# EAGLE board Schematic (EAGLE 9.6.2)
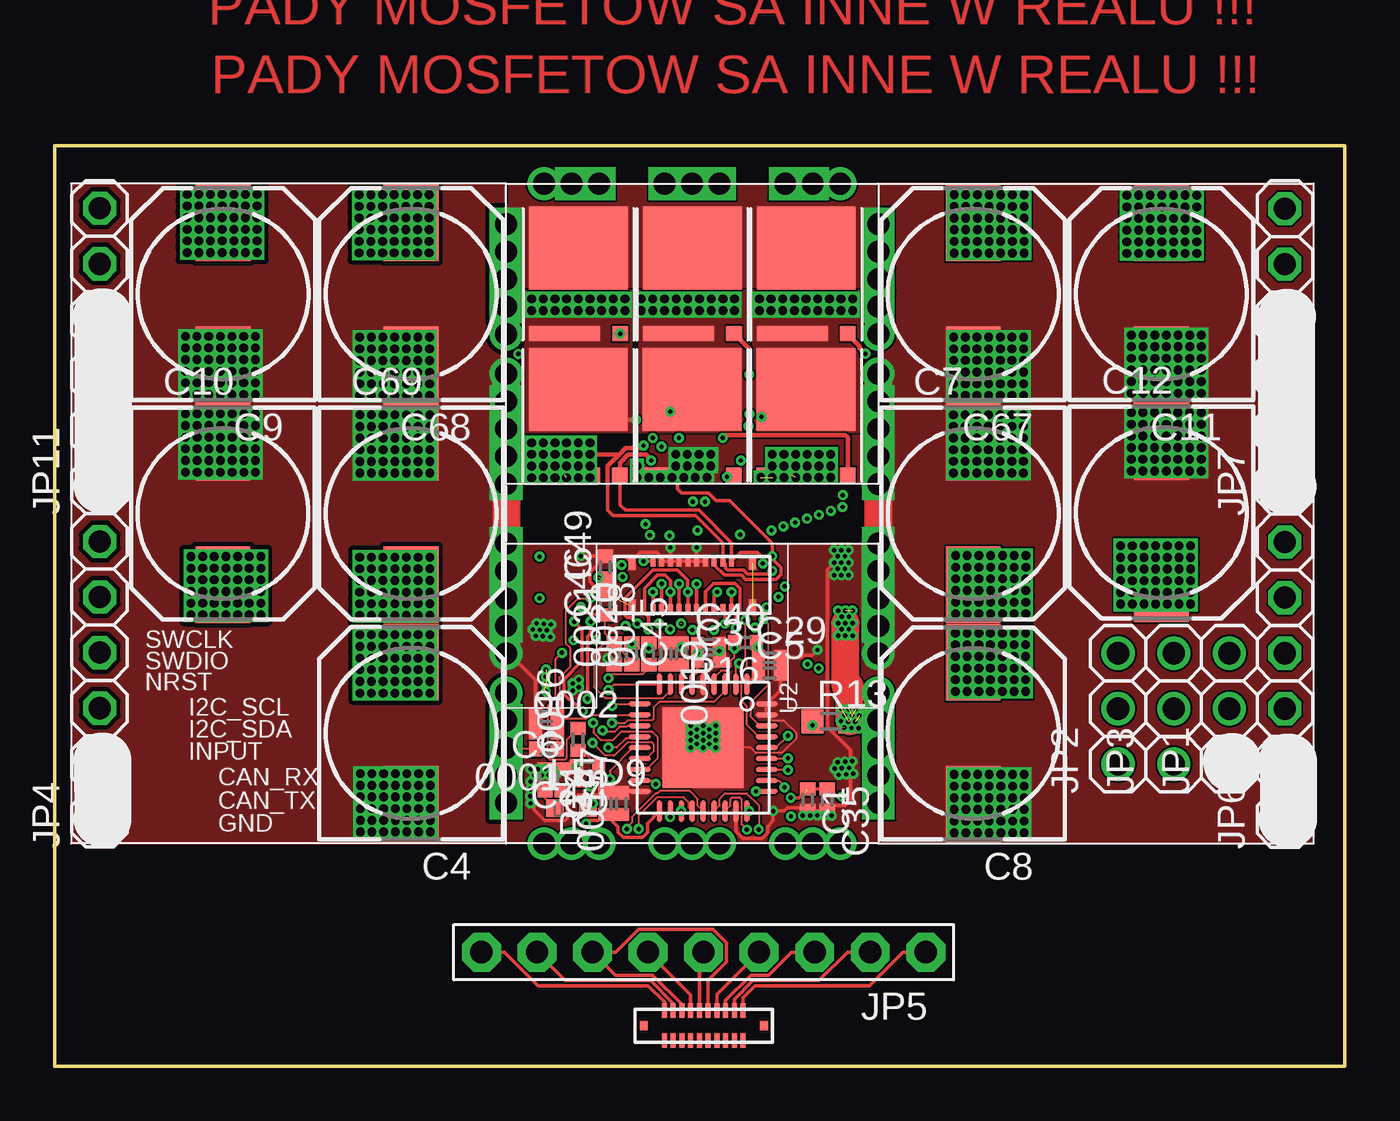
[diagram p1: board, top side]
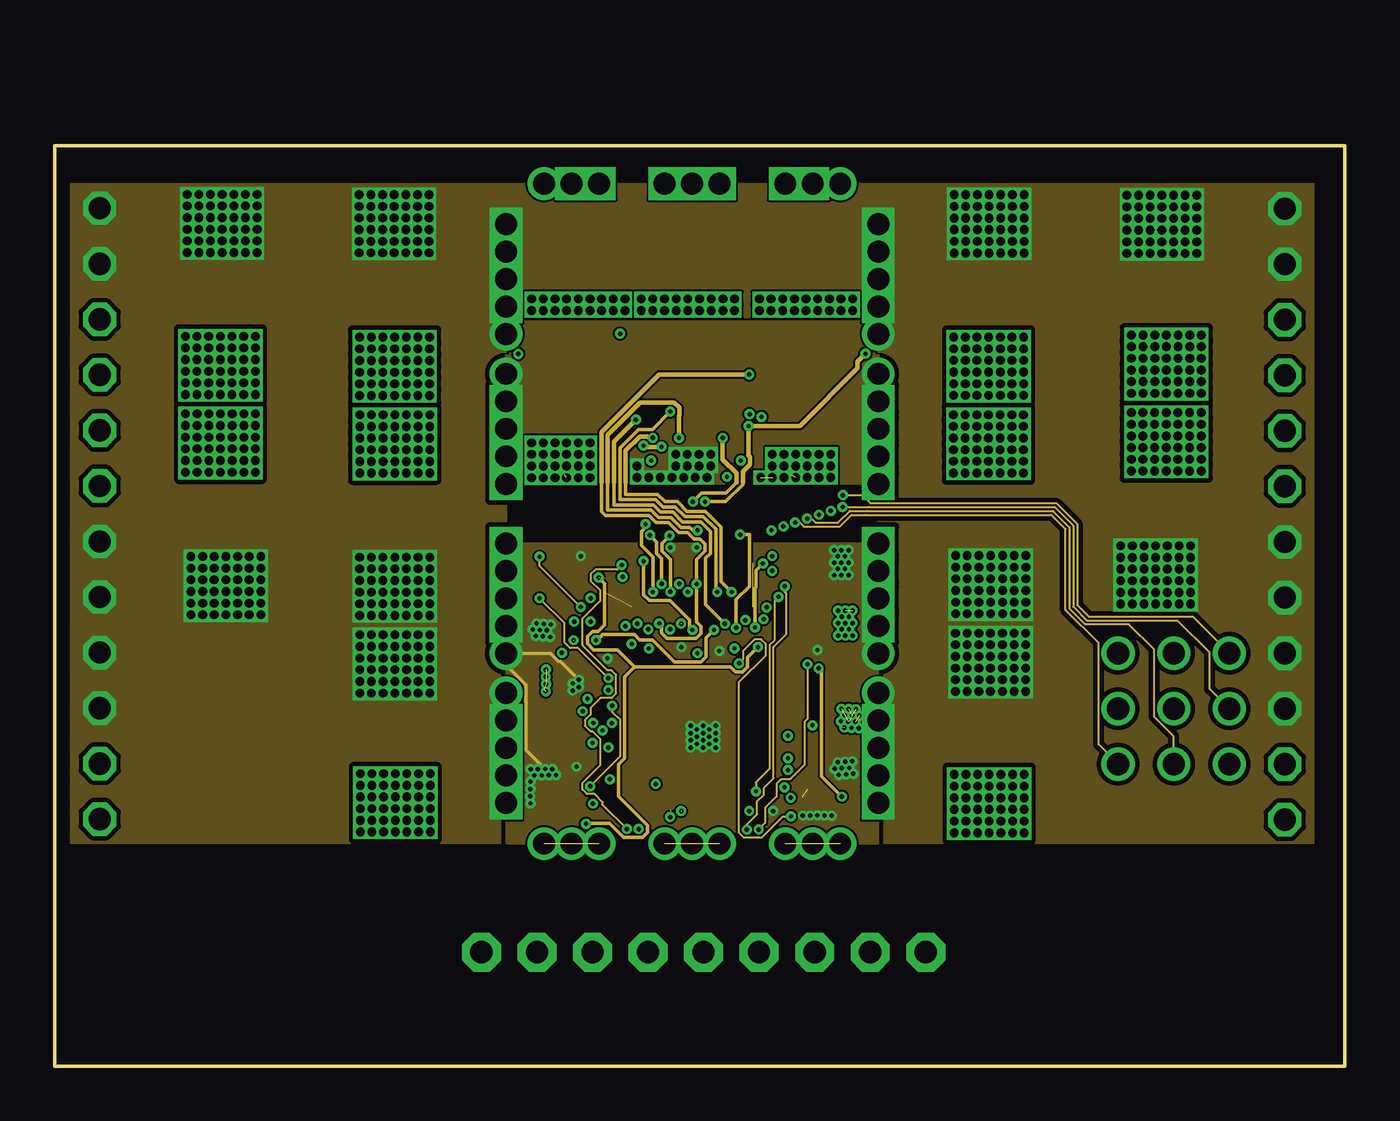
[diagram p2: board, inner layer Route2]
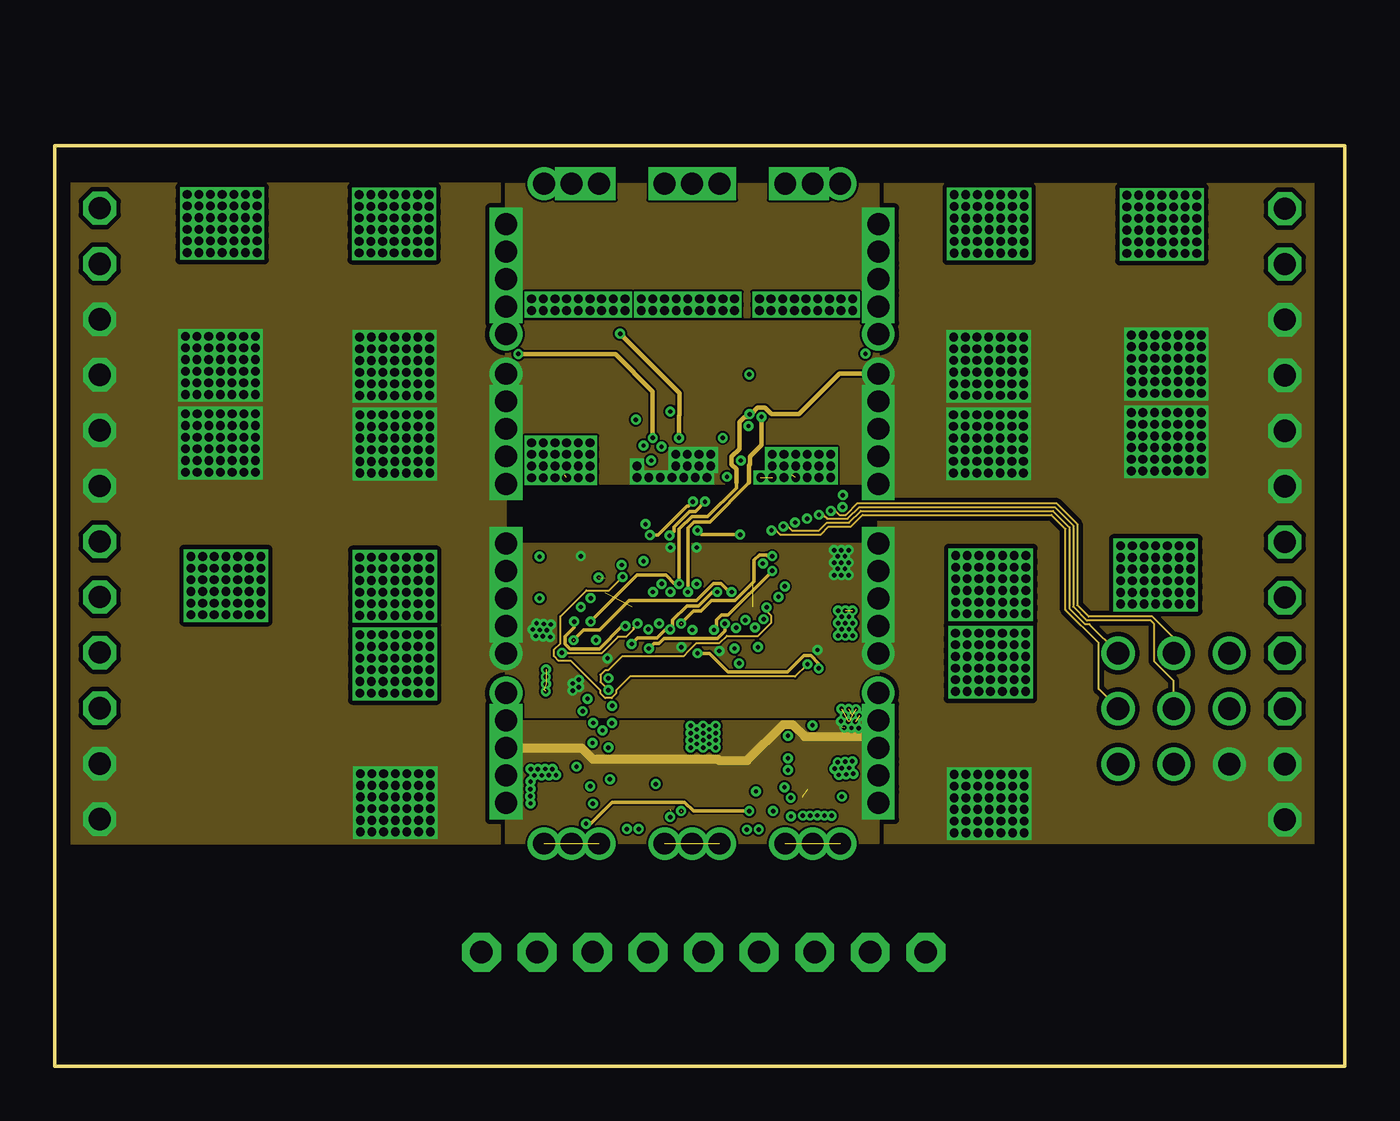
[diagram p3: board, inner layer Route15]
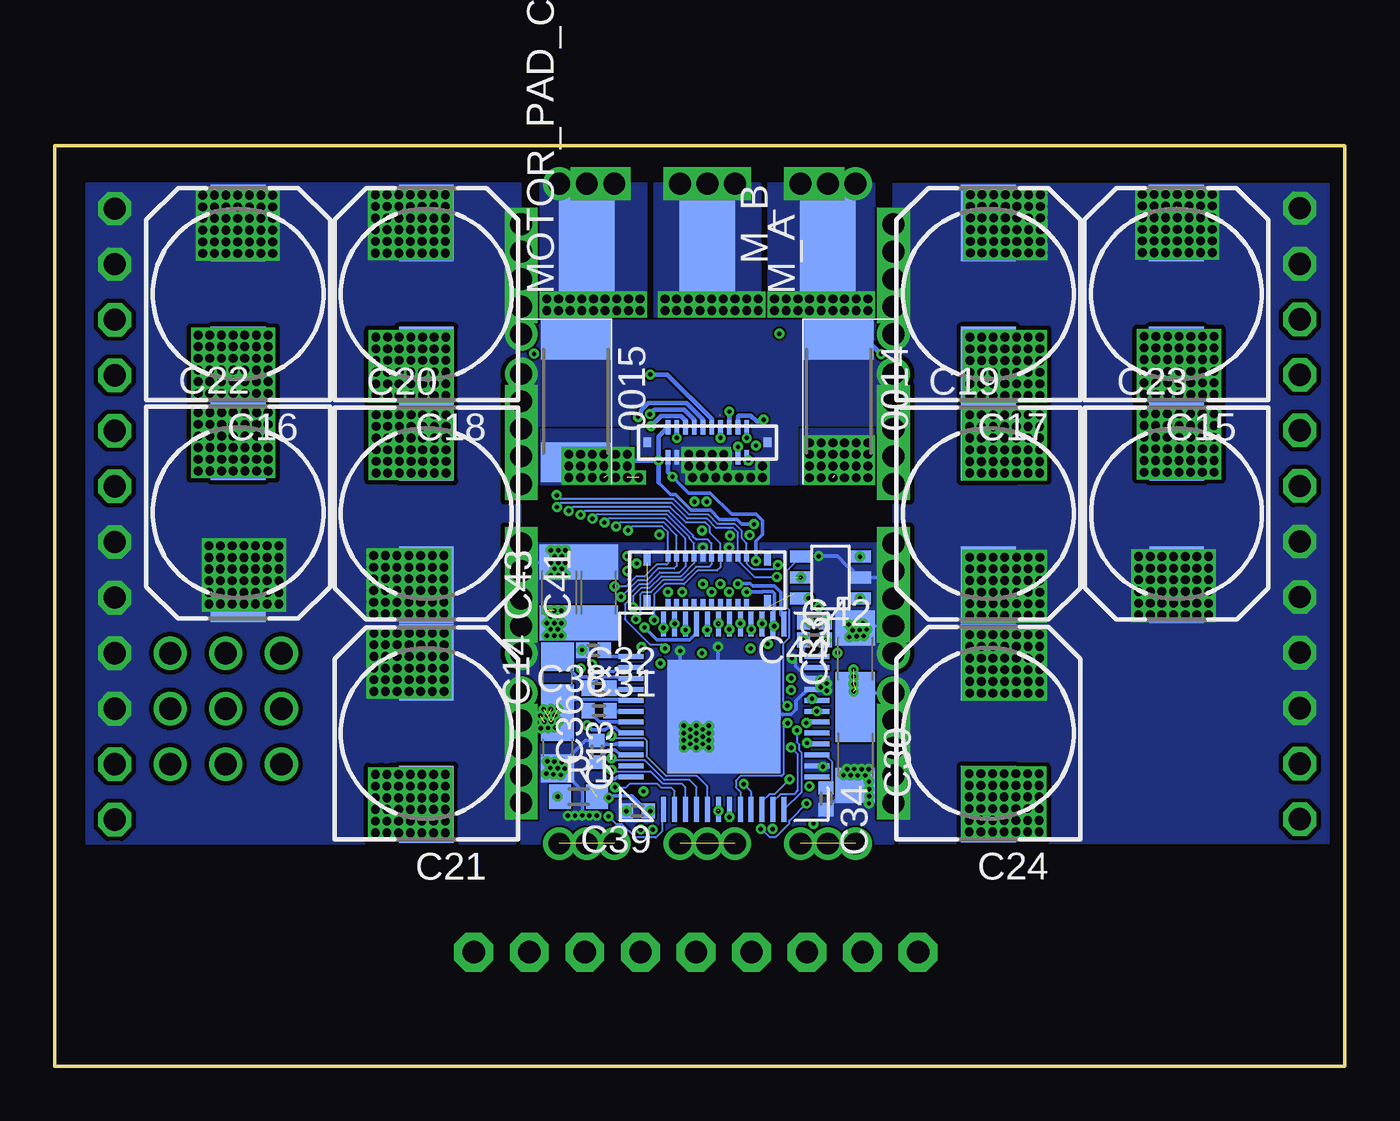
[diagram p4: board, bottom side, seen from below]

Size 59 x 42.08 mm. Coordinates in mm from the lower left corner, seen from the top.
Outline: 0,0 0,42.08 59,42.08 59,0 0,0
Copper layers (1*2*15*16): Top 0.035mm / dielectric 0.2mm / Route2 0.017mm / dielectric 0.2mm / Route15 0.017mm / dielectric 0.2mm / Bottom 0.035mm
Design rules "default *": minimum track width 3.5mil, minimum drill 0.2mm, track to track 3.5mil, track to pad 3.5mil, pad to pad 3.5mil, via to via 3.5mil, smd to smd 0mil, copper to edge 0mil, drill to drill 0mil, minimum pad ring 5mil, minimum via ring 5mil, stop-mask expansion 1mil, vias tented up to drill 0mil, thermal gap 0mil

## Footprints (pad centres in the part's own frame; a part is rotated, then mirrored left to right if it is on the bottom)
R0402 = smd 0.6 x 0.7: 1 -0.5,0; 2 0.5,0
R2512 = smd 1.8 x 3.2: 1 -2.8,0; 2 2.8,0
150CLZ-0810 = smd 3.5 x 2.5: + 3.25,0; - -3.25,0
C0805 = smd 1.3 x 1.5: 1 -0.95,0; 2 0.95,0
C1206 = smd 1.6 x 1.8: 1 -1.4,0; 2 1.4,0
1X03 = drill 1.016: 1 -2.54,0; 2 0,0; 3 2.54,0
1X06 = drill 1.016 octagon: 1 -6.35,0; 2 -3.81,0; 3 -1.27,0; 4 1.27,0; 5 3.81,0; 6 6.35,0
1X09-BIG = drill 1.016 pad 1.778 octagon: 1 -10.16,0; 2 -7.62,0; 3 -5.08,0; 4 -2.54,0; 5 0,0; 6 2.54,0; 7 5.08,0; 8 7.62,0; 9 10.16,0
SML0603 = smd 0.8 x 0.8: A 0.75,0; C -0.75,0
SMD2,54-5,08 = smd 2.54 x 5.08: 1 0,0
R0603 = smd 1 x 1.1: 1 -0.85,0; 2 0.85,0
VFQFPN36-HS = smd 1 x 0.23: 1 -2.9,2; 2 -2.9,1.5; 3 -2.9,1; 4 -2.9,0.5; 5 -2.9,0; 6 -2.9,-0.5; 7 -2.9,-1; 8 -2.9,-1.5; 9 -2.9,-2; 19 2.9,-2; 20 2.9,-1.5; 21 2.9,-1; 22 2.9,-0.5; 23 2.9,0; 24 2.9,0.5; 25 2.9,1; 26 2.9,1.5; 27 2.9,2 | smd 0.23 x 1: 10 -2,-2.9; 11 -1.5,-2.9; 12 -1,-2.9; 13 -0.5,-2.9; 14 0,-2.9; 15 0.5,-2.9; 16 1,-2.9; 17 1.5,-2.9; 18 2,-2.9; 28 2,2.9; 29 1.5,2.9; 30 1,2.9; 31 0.5,2.9; 32 0,2.9; 33 -0.5,2.9; 34 -1,2.9; 35 -1.5,2.9; 36 -2,2.905 | smd 3.7 x 3.7: GND 0,0
RECEPTACLE_20_0.4_5024262030 = smd 0.32 x 0.65: CASE_11 -0.95,-0.1; CASE_12 -0.95,-2.1; CASE_21 4.55,-0.1; CASE_22 4.55,-2.1 | smd 0.22 x 0.475: P$1 0,0; P$2 0.4,0; P$3 0.8,0; P$4 1.2,0; P$5 1.6,0; P$6 2,0; P$7 2.4,0; P$8 2.8,0; P$9 3.2,0; P$10 3.6,0; P$11 0,-2.19; P$12 0.4,-2.19; P$13 0.8,-2.19; P$14 1.2,-2.19; P$15 1.6,-2.19; P$16 2,-2.19; P$17 2.4,-2.19; P$18 2.8,-2.19; P$19 3.2,-2.19; P$20 3.6,-2.19
PLUG_20_0.4_5024302012 = smd 0.35 x 0.44: CASE_1 -0.95,-0.69; CASE_2 4.55,-0.69 | smd 0.22 x 0.66: P$1 0,0; P$2 0.4,0; P$3 0.8,0; P$4 1.2,0; P$5 1.6,0; P$6 2,0; P$7 2.4,0; P$8 2.8,0; P$9 3.2,0; P$10 3.6,0; P$11 0,-1.38; P$12 0.4,-1.38; P$13 0.8,-1.38; P$14 1.2,-1.38; P$15 1.6,-1.38; P$16 2,-1.38; P$17 2.4,-1.38; P$18 2.8,-1.38; P$19 3.2,-1.38; P$20 3.6,-1.38
S-PQFP-G48 = smd 0.229 x 1.143: 1-EN_GATE 0,0; 2-INHA 0.5,0; 3-INLA 1,0; 4-INHB 1.5,0; 5-INLB 2,0; 6-INHC 2.5,0; 7-INLC 3,0; 8-NFAULT 3.5,0; 9-NSCS 4,0; 10-SDI 4.5,0; 11-SDO 5,0; 12-SCLK 5.5,0; 25-GL_C 5.5,8.5; 26-SL_C 5,8.5; 27-SH_C 4.5,8.5; 28_GH_C 4,8.5; 29-GH_B 3.5,8.5; 30-SH_B 3,8.5; 31-SL_B 2.5,8.5; 32-GL_B 2,8.5; 33-GL_A 1.5,8.5; 34-SL_A 1,8.5; 35-SH_A 0.5,8.5; 36-GH_A 0,8.5 | smd 1.143 x 0.229: 13-PWRGD 7,1.5; 14-GND1 7,2; 15-AVDD 7,2.5; 16-SO1 7,3; 17-SO2 7,3.5; 18-SO3 7,4; 19-SN3 7,4.5; 20-SP3 7,5; 21-SN2 7,5.5; 22-SP2 7,6; 23-SN1 7,6.5; 24-SP1 7,7; 37-VCP_LSD -1.5,7; 38-VCPH -1.5,6.5; 39-CP2H -1.5,6; 40-CP2L -1.5,5.5; 41-PVDD -1.5,5; 42-CP1L -1.5,4.5; 43-CP1H -1.5,4; 44-VDRAIN -1.5,3.5; 45-GND2 -1.5,3; 46-DVDD -1.5,2.5; 47-WAKE -1.5,2; 48-VREG -1.5,1.5 | smd 5.17 x 5.17: GND 2.75,4.25
Q5B = smd 3.8 x 4.52: D -0.4,-0.635 | smd 0.686 x 0.71: G 3.51,1.27 | smd 0.686 x 3.25: S 3.51,-1.27
SOT-23 = smd 0.55 x 1: 1 0,0; 2 0.95,0; 3 1.9,0; 4 1.9,2.7; 5 0.95,2.7; 6 0,2.7

## Placement (x,y rotation side)
0001  34.8kR  [R0402]  22.49,14.5 180 top
0002  4.99kR  [R0402]  22.49,15.29 0 top
0014  5mohm  [R2512]  23.15,30.41 270 bottom
0015  5mohm  [R2512]  35.16,30.41 270 bottom
0016  34.8kR  [R0402]  23.93,14.94 90 top
0017  4.99kR  [R0402]  23.22,13.09 270 top
0018  34.8kR  [R0402]  27.17,18.85 90 top
0019  4.99kR  [R0402]  27.96,18.85 270 top
0020  34.8kR  [R0402]  26.38,18.85 90 top
0021  4.99kR  [R0402]  25.6,18.85 90 top
C1  100nF  [R0402]  34.44,12.18 270 top
C2  100nF  [R0402]  25.21,12 90 top
C3  100nF  [R0402]  29.9,18.58 0 top
C4  220uf  [150CLZ-0810]  16.3,15.22 90 top
C5  100nF  [R0402]  32.68,17.98 0 top
C6  100nF  [R0402]  22.49,15.99 180 top
C7  220uf  [150CLZ-0810]  42.01,25.27 270 top
C8  220uf  [150CLZ-0810]  42.01,15.21 90 top
C9  220uf  [150CLZ-0810]  7.7,35.31 90 top
C10  220uf  [150CLZ-0810]  7.7,25.27 270 top
C11  220uf  [150CLZ-0810]  50.61,35.31 90 top
C12  220uf  [150CLZ-0810]  50.61,25.31 270 top
C13  4.7uF  [C0805]  36,14.56 270 bottom
C14  4.7uF  [C0805]  36,17.76 90 bottom
C15  220uf  [150CLZ-0810]  7.7,35.31 90 bottom
C16  220uf  [150CLZ-0810]  50.61,35.31 90 bottom
C17  220uf  [150CLZ-0810]  16.3,35.31 90 bottom
C18  220uf  [150CLZ-0810]  42.01,35.31 90 bottom
C19  220uf  [150CLZ-0810]  16.3,25.27 270 bottom
C20  220uf  [150CLZ-0810]  42.01,25.27 270 bottom
C21  220uf  [150CLZ-0810]  42.01,15.21 90 bottom
C22  220uf  [150CLZ-0810]  50.61,25.31 270 bottom
C23  220uf  [150CLZ-0810]  7.7,25.27 270 bottom
C24  220uf  [150CLZ-0810]  16.3,15.22 90 bottom
C29  4.7uF  [R0402]  32.68,18.68 0 top
C30  22uF  [C1206]  22.38,14.23 270 bottom
C31  0.047uF  [R0402]  34.11,16.25 0 bottom
C32  0.047uF  [R0402]  34.11,17.28 0 bottom
C33  22uF  [C1206]  22.38,18.63 90 bottom
C34  1uF  [R0402]  23.72,12.22 270 bottom
C35  4.7uF  [R0402]  35.33,12.18 270 top
C36  1uF  [R0402]  34.2,14.4 90 bottom
C37  4.7uF  [R0402]  25.91,12 90 top
C38  1uF  [R0402]  34.37,19.01 180 bottom
C39  1uF  [R0402]  32.35,11.66 180 bottom
C40  4.7uF  [R0402]  29.9,19.28 0 top
C41  22uF  [C1206]  34.12,21.65 90 bottom
C42  1nF  [R0402]  24.26,19.48 0 bottom
C43  22uF  [C1206]  35.92,21.65 90 bottom
C44  1nF  [R0402]  24.26,20.33 180 bottom
C45  100nF  [R0402]  28.66,18.85 90 top
C46  100nF  [R0402]  25.18,21.13 90 top
C47  100nF  [R0402]  24.36,13.69 180 top
C49  100nF  [R0402]  25.18,22.82 90 top
C67  220uf  [150CLZ-0810]  42.01,35.31 90 top
C68  220uf  [150CLZ-0810]  16.3,35.31 90 top
C69  220uf  [150CLZ-0810]  16.3,25.27 270 top
JP1  [1X03]  53.71,16.34 90 top
JP2  [1X03]  48.63,16.34 90 top
JP3  [1X03]  51.17,16.34 90 top
JP4  [1X06]  2.06,17.64 90 top
JP5  [1X09-BIG]  29.67,5.21 180 top
JP6  [1X06]  56.25,17.61 90 top
JP7  [1X06]  56.25,32.86 90 top
JP11  [1X06]  2.06,32.88 90 top
LED9  Red  [SML0603]  23.62,11.8 0 top
M_A  [SMD2,54-5,08]  23.64,37.81 0 bottom
M_B  [SMD2,54-5,08]  29.15,37.81 180 bottom
MOTOR_PAD_C  [SMD2,54-5,08]  34.66,37.81 0 bottom
R1  180nH  [R0603]  35.04,12.32 0 bottom
R13  100R  [R0603]  35.5,15.77 0 top
R16  100K  [R0402]  31.58,19.37 180 top
R24  10k  [R0402]  22.43,13.09 270 top
U2  STM32F10XTXU6HS  [VFQFPN36-HS]  29.65,14.56 270 top
U$1  RECEPTACLE_20_0.4_5024262030  [RECEPTACLE_20_0.4_5024262030]  30.96,23.32 0 bottom
U$2  PLUG_20_0.4_5024302012  [PLUG_20_0.4_5024302012]  27.88,2.54 0 top
U$21  DRV8305  [S-PQFP-G48]  31.15,11.73 0 bottom
U$22  CSD17573Q5B  [Q5B]  29.79,37 270 top
U$23  CSD17573Q5B  [Q5B]  29.79,30.54 270 top
U$24  CSD17573Q5B  [Q5B]  24.59,37 270 top
U$25  CSD17573Q5B  [Q5B]  24.58,30.54 270 top
U$26  CSD17573Q5B  [Q5B]  35,37 270 top
U$28  CSD17573Q5B  [Q5B]  34.99,30.54 270 top
U$30  PLUG_20_0.4_5024302012  [PLUG_20_0.4_5024302012]  30.95,29.22 0 bottom
U$31  TPD4E001  [SOT-23]  22.17,21.39 90 bottom
U$32  RECEPTACLE_20_0.4_5024262030  [RECEPTACLE_20_0.4_5024262030]  30.96,20.9 180 top

## Tracks (layer width: path | path; a pad name or v marks a point on that pad's centre or on a via)
+3V3  (via drill 0.2)  (2 unrouted)
  Top 0.089: U2.27 v31.76,11.66 | 32.17,17.98 C5.1 C29.1 32.08,18.77 R16.1
  Top 0.152: C35.1 C1.1 34.03,12.27 v33.66,12.27 | R16.1 32.16,19.3 v32.16,19.16 | U2.1 32.17,17.98 | C2.1 C37.1 | C2.1 25.77,10.94 25.77,10.68 26,10.45 26.87,10.45 27.1,10.68 27.1,11.11 U2.19 | v24.3,11.08 24.45,11.23 24.84,11.23 25.11,11.5 C2.1
  Route2 0.152: v32.16,19.16 31.69,18.69 31.69,18.25 31.46,18.02 31.14,18.02 30.91,18.25 26.52,18.25 | U$31.5 25.15,22.07 25.15,20.16 24.86,19.87 24.59,19.87 24.36,19.64 24.36,19.32 24.65,19.04 25.73,19.04 26.52,18.25 | 26.52,18.25 26.07,17.79 26.07,14.08 25.78,13.79 25.78,12.32 27.1,11 27.1,10.68 26.87,10.45 26,10.45 25.36,11.09 v24.31,11.09 v24.3,11.08
  Route15 0.152: v24.3,11.08 24.51,11.08 25.48,12.05 28.81,12.05 29.2,11.66 v31.76,11.66
  Bottom 0.089: v31.76,11.66 C39.1 | R1.2 34.19,12.48
  Bottom 0.152: U$21.48-VREG 33.28,13.23 33.37,13.14 33.53,13.14 34.19,12.48 | v31.76,11.66 31.89,11.66 32.59,12.36 33.53,12.36 33.62,12.27 v33.66,12.27
  other vias: 24.87,22.34
ADC_CA  (via drill 0.2)
  Top 0.089: U2.15 26.76,14.07 27.07,14.07 27.39,14.39 27.39,14.73 27.31,14.81 26.2,14.81 25.59,14.2 25.17,14.2 24.96,14.41 24.96,14.42 v24.6,14.78
  Bottom 0.089: 24.42,14.73 U$21.16-SO1 24.2,14.78 v24.6,14.78
ADC_CC  (via drill 0.2)
  Top 0.089: U2.16 27.06,13.56 27.57,14.07 27.57,15.05 27.31,15.31 25.93,15.31 25.54,14.92 24.97,14.92 24.64,15.25 24.64,15.68 v24.63,15.69
  Bottom 0.089: U$21.18-SO3 24.59,15.73 v24.63,15.69
ADC_VA  (via drill 0.2)
  Top 0.089: U2.7 C45.1 0019.2 27.32,18.35 | 27.32,18.35 0018.1 | 27.32,18.35 26.88,17.92 25.5,17.92 v25.32,17.74
  Route2 0.089: v25.32,17.74 23.94,19.11 23.58,19.11 23.31,19.38 23.31,20.26 U$31.1
  other vias: 22.17,21.39
ADC_VB  (via drill 0.2)
  Top 0.089: U2.8 28.16,17.16 27.82,16.83 25.65,16.83 25.64,16.83 25.35,16.83 25.34,16.83 25.18,16.83 24.66,17.34 24.66,18.87 25.14,19.35 0021.2 | 0021.2 25.9,19.05 25.9,19 26.38,18.51 0020.1 | 25.6,19.19 0021.2 | 0021.2 25.18,19.77 C46.1 24.72,20.63 24.66,20.69 24.36,20.69 v24.06,20.99
  Route2 0.089: v24.06,20.99 22.17,22.88 U$31.3
  other vias: 22.17,23.29
ADC_VC  (via drill 0.2)
  Top 0.089: 0016.1 24.12,14.43 C47.1 24.49,13.32 v24.49,12.8 23.43,12.8 0017.2 | v25.5,16.47 25.58,16.56 U2.10
  Route2 0.089: v24.49,12.8 25.86,14.16 25.86,15.84 25.5,16.2 v25.5,16.47
  Bottom 0.089: U$31.4 25.42,22.75 25.43,22.75 25.51,22.67 25.51,20.96 25.4,20.85 25.4,19.6 25.68,19.32 25.68,16.65 v25.5,16.47
ADC_VMOT  (via drill 0.2)
  Top 0.089: U2.11 24.48,16.05 24.3,15.87 23.11,15.87 C6.1 | C6.1 23.02,15.99 23.02,15.32 0002.2 0001.1 | v24.51,21.4 24.46,21.35 23.91,21.35 23.36,20.81 23.36,19.33 23.56,19.13 23.56,18.25 23.09,17.77 23.09,16.09 C6.1
  Bottom 0.089: v24.51,21.4 U$31.6 24.91,21.36
CAN_RX  (via drill 0.2)
  Top 0.089: U2.23 29.4,11.91 29.4,12.22 29.05,12.57 27.67,12.57 27.57,12.47 27.48,12.47 26.39,11.38 26.39,11.15 26.17,10.92 v26.17,10.84
  Route2 0.089: v26.17,10.84 25.06,11.95 25.06,12.07 24.69,12.44 24.34,12.44 24.13,12.65 24.13,12.95 24.96,13.77 24.96,14.93 24.59,15.3 24.51,15.3 24.25,15.56 24.25,15.82 24.51,16.08 24.51,16.37 24.97,16.83 25.47,16.83 25.68,17.04 25.68,17.89 25.47,18.1 25.29,18.1 24.15,19.24 24.15,20.48 24.94,21.27 24.94,21.77 24.51,22.19 24.51,22.49 24.72,22.7 25.72,22.7 v25.93,22.92 | v36.04,26.11 36.93,26.11 37.3,25.74 45.8,25.74 46.76,24.78 46.76,21.08 47.29,20.55 52.04,20.55 JP1.3
  Bottom 0.089: 27.14,22.76 27.36,22.98 U$1.P$10 27.36,23.91 | 27.14,22.76 27.11,22.73 | 27.14,22.76 27.11,22.76 27.08,22.73 26.11,22.73 v25.93,22.92 | 27.36,23.91 | 27.36,23.91 27.58,24.13 27.58,24.48 27.89,24.79 28.68,24.79 29.1,25.21 29.99,25.21 30.7,25.93 35.86,25.93 v36.04,26.11
CAN_TX  (via drill 0.2)
  Top 0.089: U2.24 30.41,11.91 30.41,12.22 30.66,12.47 31.65,12.47 32.2,11.92 v32.2,10.82
  Route2 0.089: v34.42,18.38 34.42,15.86 34.29,15.73 34.29,13.78 33.62,13.11 33.22,13.11 33.01,12.9 33.01,12.33 32.49,11.81 32.49,11.12 v32.2,10.82 | v36.03,25.57 37.22,25.57 37.22,25.56 45.73,25.56 46.58,24.71 46.58,21.01 47.21,20.38 51.35,20.38 52.82,18.9 52.82,17.24 JP1.2
  Route15 0.089: v25.97,22.37 25.36,21.76 24.32,21.76 23.12,20.57 23.12,19.33 22.84,19.04 22.84,18.75 23.05,18.53 23.61,18.53 24.96,17.19 24.96,17.04 25.17,16.83 25.47,16.83 25.68,17.04 25.68,17.19 26.31,17.81 33.86,17.81 v34.42,18.38
  Bottom 0.089: v25.97,22.37 27,22.37 27.75,23.13 U$1.P$9 27.76,23.9 | 27.76,23.9 | 27.76,23.9 27.76,24.4 27.97,24.61 28.75,24.61 29.17,25.03 30.06,25.03 30.77,25.75 35.85,25.75 v36.03,25.57
ENGATE  (via drill 0.2)
  Top 0.089: U2.2 31.15,18.27 v31.3,18.42
  Route2 0.089: 31.29,10.96 31.29,10.66 31.5,10.45 32.34,10.45 33.3,11.42 v33.67,11.42 | 31.3,10.97 31.29,10.96 | 31.29,10.96 31.29,17.56 32.52,18.79 32.52,19.31 32.31,19.52 32.01,19.52 31.48,18.99 31.48,18.6 v31.3,18.42
  Bottom 0.089: 31.15,12.11 U$21.1-EN_GATE 31.22,11.66 31.22,10.74 31.5,10.45 32.44,10.45 33.07,11.08 33.33,11.08 v33.67,11.42
GH_A  (via drill 0.2, 0.2 pad 0.45)  (1 unrouted)
  Top 0.152: v31.16,20.04 31.16,20.53 31.35,20.72 31.35,21.84 31.12,22.07 30.14,22.07 29.76,21.69 U$32.P$4
  Route2 0.152: v31.16,20.04 31.16,21.33 31.77,21.94 31.77,24.3 v31.35,24.3 | 25.29,26.69 25.29,25.42 27.28,25.42 27.61,25.09 28.18,25.09 28.63,24.63 29.05,24.63 29.18,24.5 v29.4,24.5
  Route2 0.203: v28.55,28.73 28.55,29.74 28.57,29.76 28.57,30.11 28.32,30.35 26.78,30.35 25.29,28.86 25.29,26.69
  Route15 0.152: v31.35,24.3 29.59,24.3 v29.4,24.5
  Route15 0.203: U$24.G 28.57,30.78 28.57,29.76 | v28.55,28.73 | 28.55,29.74 v28.55,28.73
  Bottom 0.152: U$21.36-GH_A 31.16,20.21 v31.16,20.04
  Bottom 0.203: v28.55,28.73 U$30.P$7
  other vias: 25.86,33.49
GH_B  (via drill 0.2, 0.2 pad 0.45)
  Top 0.152: U$32.P$5 | U$32.P$5 v29.36,22.05
  Top 0.203: 31.75,31.64 v31.76,31.63 31.76,32.79 U$22.G
  Route2 0.152: v27.64,20.24 27.75,20.13 27.75,19.81 28.01,19.55 29.33,19.55 29.55,19.78 29.55,20.11 29.36,20.31 v29.36,22.05 29.36,23.16 29.75,23.55 29.75,23.87 29.52,24.1 29.23,24.1 28.95,24.39 28.53,24.39 28.08,24.85 27.51,24.85 27.18,25.18 25.19,25.18 25,25.37 25,26.69
  Route2 0.203: v31.76,31.63 27.64,31.63 25,28.99 25,26.69
  Bottom 0.152: U$21.29-GH_B v27.64,20.24
  Bottom 0.203: U$30.P$6 28.95,29.58 31,31.63 v31.76,31.63
GH_C  (via drill 0.2, 0.2 pad 0.45)
  Top 0.152: U$32.P$8 v28.16,21.69 28.16,22.21 27.92,22.45 27.57,22.45 26.96,21.84 26.96,20.72 27.15,20.53 v27.15,19.97
  Top 0.203: v37.08,32.58 36.81,32.84 36.81,32.92 36.27,33.46 U$26.G
  Route2 0.152: v28.16,21.69 28.16,23.16 27.76,23.55 27.76,23.9 v28.12,24.25 | 31.47,26.68 31.47,26.6 30.68,25.81 v29.74,25.81
  Route2 0.203: 31.47,26.68 31.47,27.19 31.79,27.52 31.79,27.87 31.73,27.93 v31.73,29.27 34.08,29.27 36.72,31.91 36.72,32.22 v37.08,32.58
  Route15 0.152: v29.74,25.81 29.29,25.37 29.03,25.37 28.31,24.65 28.31,24.45 v28.12,24.25
  Bottom 0.152: U$21.28_GH_C v27.15,19.97
  Bottom 0.203: U$30.P$3 30.15,29.54 30.16,29.54 30.36,29.74 31.26,29.74 v31.73,29.27
GL_A  (via drill 0.2, 0.2 pad 0.45)
  Top 0.152: v32.38,22.98 32.38,23.25 32.13,23.49 31.36,23.49 U$32.P$11 30.96,23.92 29.46,25.42 26.09,25.42 25.85,25.66 25.85,26.68
  Top 0.203: 25.85,26.68 U$25.G 25.85,27.59 26.23,27.96 27.04,27.96 27.15,27.85 27.15,27.82 v27.27,27.69
  Route2 0.152: v32.02,20.06 32.02,21.85 32.06,21.89 32.06,22.66 v32.38,22.98
  Bottom 0.089: U$30.P$20 27.32,27.83
  Bottom 0.152: U$21.33-GL_A | U$21.33-GL_A 29.65,19.9 29.64,19.89 29.64,19.81 29.96,19.49 31.46,19.49 v32.02,20.06
  Bottom 0.203: v27.27,27.69 27.27,27.78 27.32,27.83
GL_B  (via drill 0.2, 0.2 pad 0.45)
  Top 0.152: U$32.P$20 v26.93,23.09 | v26.93,23.09
  Top 0.203: v30.74,26.95 30.83,27.03 U$23.G
  Route2 0.152: v29.16,19.94 29.04,20.07 29.04,20.39 28.15,21.29 27.19,21.29 26.93,21.55 v26.93,23.09
  Bottom 0.152: U$21.32-GL_B 29.15,19.96 v29.16,19.94 | v26.93,23.09 26.93,24.01 26.63,24.32 26.63,24.95 26.92,25.24 28.06,25.24 29.02,26.21 30.01,26.21 30.32,26.52 30.32,26.53 v30.74,26.95
  Bottom 0.203: U$30.P$11 30.95,27.15 v30.74,26.95
GL_C  (via drill 0.2, 0.2 pad 0.45)
  Top 0.152: U$32.P$9 v27.76,22.05
  Top 0.203: v30.55,28.73 30.68,28.85 36.14,28.85 36.26,28.73 U$28.G
  Route2 0.152: v27.76,22.05 27.76,23.22 27.52,23.45 27.52,23.97 v27.22,24.28 | v29.18,25.81 29.57,26.21 30.7,26.21 31.17,26.68
  Route2 0.203: v30.55,28.73 30.55,27.73 31.17,27.11 31.17,26.68
  Route15 0.152: v29.18,25.81 28.98,25.61 28.92,25.61 27.59,24.28 v27.22,24.28
  Bottom 0.152: U$21.25-GL_C 25.65,20.5 25.78,20.63 25.78,21.65 26.08,21.95 27.07,21.95 27.19,22.07 27.52,22.07 27.54,22.05 v27.76,22.05
  Bottom 0.203: U$30.P$2 v30.55,28.73
GND  (via drill 0.2, 0.4, 1)  (12 unrouted)
  Top 0.089: C29.2 C5.2 | U2.35 32.81,15.81 33.34,15.81 33.89,15.25 33.89,14.95 33.25,14.31 32.07,14.31 31.81,14.57 v29.65,14.57 | v50.84,31.83 C16.- 50.61,32.14 v50.84,32.37
  Top 0.152: U2.26 31.15,10.74 31.48,10.42 32.35,10.42 32.59,10.66 32.59,10.94 32.85,11.21 C39.2 33.36,11.66 33.51,11.81 34.31,11.81 C1.2 | C1.2 C35.2 35.58,11.93 36.16,11.93 36.39,12.16 36.39,14.45 35.33,15.5 35.33,22.71 v35.64,23.02 | U$32.P$18 U$32.P$19 27.76,23.27 27.53,23.5 26.78,23.5 26.41,23.13 U$32.CASE_22 26.09,23.31 C49.2 | U$32.P$18 U$32.P$17 U$32.P$16 U$32.P$15 | U$32.P$15 U$32.P$14 | U$32.P$18 v28.16,23.71 | U$32.P$15 v29.36,23.71 | U2.5 29.65,17.84 C3.2 v30.4,18.98 C40.2 | C5.2 33.18,17.18 U2.36 U2.35 | 0019.1 C45.2 v28.66,19.16 | v24.06,23.32 C49.2 | C46.2 24.95,21.85 24.76,21.85 24.48,22.13 24.48,22.61 C49.2 | U2.18 25.97,12.56 C37.2 C2.2 25.1,12.39 23.93,12.39 23.44,11.9 23.44,11.33 23.34,11.23 22.4,11.23 21.91,11.72 21.91,12.96 22.43,13.47 R24.1 0017.1 23.76,13.59 C47.2 | v34.21,11.45 C1.2 | 0002.1 C6.2 21.99,17.66 20.78,18.87 v20.64,18.87 | C29.2 34.17,18.68 34.26,18.77 34.62,18.77 v34.88,19.03 | v20.64,23.9 20.64,26.53 v20.64,26.63 | 25.57,18.35 v25.28,18.64
  Top 1.27: v37.66,31.65 v37.66,30.4 v37.66,29.14 v37.66,27.88 v37.66,26.63 v37.66,23.9 v37.66,22.64 v37.66,21.39 v37.66,20.13 v37.66,18.87 | v20.64,31.65 v20.64,30.4 v20.64,29.14 v20.64,27.88 20.64,26.53 | v20.64,26.63 v20.64,23.9 v20.64,22.64 v20.64,21.39 v20.64,20.13 v20.64,18.87
  Route2 0.152: R24.1 21.56,14.46 21.56,17.43 20.64,18.35 v20.64,18.87 22.66,18.87 23.03,18.5 23.13,18.5 v23.97,17.66
  Bottom 0.089: U$1.P$8 v28.16,23.71 | U$1.P$5 v29.36,23.71 | C47.2 23.9,13.73 U$21.14-GND1
  Bottom 0.152: U$21.45-GND2 33.34,14.73 33.36,14.71 34.02,14.71 C36.2 34.72,14.9 C13.2 35.43,13.03 35.32,13.03 34.85,12.57 34.85,11.7 34.76,11.6 34.36,11.6 v34.21,11.45 | C41.2 34.16,23.02 v35.64,23.02 37.58,23.02 37.66,23.11 | U$21.22-SP2 U$21.21-SN2 24.57,17.23 25.1,16.69 25.1,16.31 25.33,16.08 25.79,16.08 25.9,15.98 U$21.GND | v28.66,19.16 28.66,16.24 U$21.GND | U$21.GND 30.4,17.98 v30.4,18.98 | v20.64,20.13 22.29,20.13 C33.2 | v20.64,21.39 20.62,21.41 20.62,22.12 20.85,22.34 U$31.2 22.68,22.85 22.74,22.85 23.21,23.32 v24.06,23.32 | C34.2 22.62,12.83 C30.2 22.38,13.54 R24.1 | C38.2 v34.88,19.03 | v25.28,18.64 25.12,18.49 25.12,18.29 24.57,17.73 U$21.22-SP2 | U$21.GND 29.65,14.72 v29.65,14.57 | U$21.22-SP2 24.04,17.73 v23.97,17.66
  other vias: 26.63,26.91 26.63,27.44 27.17,26.91 27.7,26.91 28.23,26.91 28.77,26.91 29.3,26.91 29.83,26.91 28.4,27.44 28.4,27.98 28.93,27.44 29.46,27.44 30,27.44 28.93,27.98 29.46,27.98 30,27.98 32.85,11.66 23.86,13.69 22.43,13.59 23.97,17.33 23.69,17.5 23.69,17.17 35.97,23.02 36.3,23.02 35.81,22.74 36.14,22.74 35.81,23.31 36.14,23.31 29.65,14.9 29.37,14.73 29.94,14.73 29.94,15.06 29.37,15.06 29.65,15.23 30.23,14.9 30.23,15.23 29.94,15.39 29.65,15.56 29.37,15.39 29.08,14.9 29.08,15.23 29.08,15.56 30.23,15.56 30.23,14.57 29.08,14.57 35.97,22.45 35.64,22.45 36.3,22.45 35.97,23.59 36.3,23.59 35.64,23.59 22,19.67 22.33,19.65 22.18,19.94 21.86,19.97 22.51,19.92 22.66,19.62 22.36,20.22 22.69,20.2 22.03,20.25 22.1,13.58 21.77,13.58 21.93,13.29 22.27,13.29 22.6,13.3 22.76,13.59 22.93,13.31 21.76,13.01 21.76,12.67 21.75,12.34 21.76,12.01 34.54,11.45 34.87,11.46 35.2,11.45 35.53,11.45 36,13.62 35.67,13.59 36.33,13.64 35.86,13.31 36.19,13.34 35.81,13.89 36.14,13.92 36.47,13.94 36.52,13.36 41.67,13.33 41.14,13.33 42.74,13.33 42.2,13.33 43.27,13.33 43.8,13.33 44.34,13.33 41.67,12.8 41.14,12.8 42.74,12.8 42.2,12.8 43.27,12.8 43.8,12.8 44.34,12.8 41.67,12.27 41.14,12.27 42.74,12.27 42.2,12.27 43.27,12.27 43.8,12.27 44.34,12.27 41.67,11.73 41.14,11.73 42.74,11.73 42.2,11.73 43.27,11.73 43.8,11.73 44.34,11.73 41.67,11.2 41.14,11.2 42.74,11.2 42.2,11.2 43.27,11.2 43.8,11.2 44.34,11.2 41.67,10.67 41.14,10.67 42.74,10.67 42.2,10.67 43.27,10.67 43.8,10.67 44.34,10.67 41.64,33.34 41.11,33.34 42.71,33.34 42.18,33.34 43.24,33.34 43.78,33.34 44.31,33.34 41.64,32.8 41.11,32.8 42.71,32.8 42.18,32.8 43.24,32.8 43.78,32.8 44.31,32.8 41.64,32.27 41.11,32.27 42.71,32.27 42.18,32.27 43.24,32.27 43.78,32.27 44.31,32.27 41.64,31.74 41.11,31.74 42.71,31.74 42.18,31.74 43.24,31.74 43.78,31.74 44.31,31.74 41.64,31.2 41.11,31.2 42.71,31.2 42.18,31.2 43.24,31.2 43.78,31.2 44.31,31.2 41.64,30.67 41.11,30.67 42.71,30.67 42.18,30.67 43.24,30.67 43.78,30.67 44.31,30.67 41.64,29.79 41.1,29.79 42.7,29.79 42.17,29.79 43.24,29.79 43.77,29.79 44.3,29.79 41.64,29.25 41.1,29.25 42.7,29.25 42.17,29.25 43.24,29.25 43.77,29.25 44.3,29.25 41.64,28.72 41.1,28.72 42.7,28.72 42.17,28.72 43.24,28.72 43.77,28.72 44.3,28.72 41.64,28.19 41.1,28.19 42.7,28.19 42.17,28.19 43.24,28.19 43.77,28.19 44.3,28.19 41.64,27.65 41.1,27.65 42.7,27.65 42.17,27.65 43.24,27.65 43.77,27.65 44.3,27.65 41.64,27.12 41.1,27.12 42.7,27.12 42.17,27.12 43.24,27.12 43.77,27.12 44.3,27.12 49.77,33.43 49.24,33.43 50.84,33.43 50.3,33.43 51.37,33.43 51.9,33.43 52.44,33.43 49.77,32.9 49.24,32.9 50.84,32.9 50.3,32.9 51.37,32.9 51.9,32.9 52.44,32.9 49.77,32.37 49.24,32.37 50.3,32.37 51.37,32.37 51.9,32.37 52.44,32.37 49.77,31.83 49.24,31.83 50.3,31.83 51.37,31.83 51.9,31.83 52.44,31.83 49.77,31.3 49.24,31.3 50.84,31.3 50.3,31.3 51.37,31.3 51.9,31.3 52.44,31.3 49.77,30.77 49.24,30.77 50.84,30.77 50.3,30.77 51.37,30.77 51.9,30.77 52.44,30.77 49.76,29.88 49.23,29.88 50.83,29.88 50.3,29.88 51.37,29.88 51.9,29.88 52.43,29.88 49.76,29.35 49.23,29.35 50.83,29.35 50.3,29.35 51.37,29.35 51.9,29.35 52.43,29.35 49.76,28.82 49.23,28.82 50.83,28.82 50.3,28.82 51.37,28.82 51.9,28.82 52.43,28.82 49.76,28.28 49.23,28.28 50.83,28.28 50.3,28.28 51.37,28.28 51.9,28.28 52.43,28.28 49.76,27.75 49.23,27.75 50.83,27.75 50.3,27.75 51.37,27.75 51.9,27.75 52.43,27.75 49.76,27.22 49.23,27.22 50.83,27.22 50.3,27.22 51.37,27.22 51.9,27.22 52.43,27.22 16.64,13.37 17.18,13.37 15.58,13.37 16.11,13.37 15.04,13.37 14.51,13.37 13.98,13.37 16.64,12.84 17.18,12.84 15.58,12.84 16.11,12.84 15.04,12.84 14.51,12.84 13.98,12.84 16.64,12.31 17.18,12.31 15.58,12.31 16.11,12.31 15.04,12.31 14.51,12.31 13.98,12.31 16.64,11.77 17.18,11.77 15.58,11.77 16.11,11.77 15.04,11.77 14.51,11.77 13.98,11.77 16.64,11.24 17.18,11.24 15.58,11.24 16.11,11.24 15.04,11.24 14.51,11.24 13.98,11.24 16.64,10.71 17.18,10.71 15.58,10.71 16.11,10.71 15.04,10.71 14.51,10.71 13.98,10.71 16.61,33.33 17.14,33.33 15.54,33.33 16.08,33.33 15.01,33.33 14.48,33.33 13.94,33.33 16.61,32.8 17.14,32.8 15.54,32.8 16.08,32.8 15.01,32.8 14.48,32.8 13.94,32.8 16.61,32.26 17.14,32.26 15.54,32.26 16.08,32.26 15.01,32.26 14.48,32.26 13.94,32.26 16.61,31.73 17.14,31.73 15.54,31.73 16.08,31.73 15.01,31.73 14.48,31.73 13.94,31.73 16.61,31.2 17.14,31.2 15.54,31.2 16.08,31.2 15.01,31.2 14.48,31.2 13.94,31.2 16.61,30.66 17.14,30.66 15.54,30.66 16.08,30.66 15.01,30.66 14.48,30.66 13.94,30.66 16.62,29.78 17.15,29.78 15.55,29.78 16.08,29.78 15.02,29.78 14.48,29.78 13.95,29.78 16.62,29.25 17.15,29.25 15.55,29.25 16.08,29.25 15.02,29.25 14.48,29.25 13.95,29.25 16.62,28.71 17.15,28.71 15.55,28.71 16.08,28.71 15.02,28.71 14.48,28.71 13.95,28.71 16.62,28.18 17.15,28.18 15.55,28.18 16.08,28.18 15.02,28.18 14.48,28.18 13.95,28.18 16.62,27.65 17.15,27.65 15.55,27.65 16.08,27.65 15.02,27.65 14.48,27.65 13.95,27.65 16.62,27.11 17.15,27.11 15.55,27.11 16.08,27.11 15.02,27.11 14.48,27.11 13.95,27.11 8.64,33.38 9.18,33.38 7.58,33.38 8.11,33.38 7.04,33.38 6.51,33.38 5.98,33.38 8.64,32.84 9.18,32.84 7.58,32.84 8.11,32.84 7.04,32.84 6.51,32.84 5.98,32.84 8.64,32.31 9.18,32.31 7.58,32.31 8.11,32.31 7.04,32.31 6.51,32.31 5.98,32.31 8.64,31.78 9.18,31.78 7.58,31.78 8.11,31.78 7.04,31.78 6.51,31.78 5.98,31.78 8.64,31.24 9.18,31.24 7.58,31.24 8.11,31.24 7.04,31.24 6.51,31.24 5.98,31.24 8.64,30.71 9.18,30.71 7.58,30.71 8.11,30.71 7.04,30.71 6.51,30.71 5.98,30.71 8.65,29.83 9.18,29.83 7.58,29.83 8.12,29.83 7.05,29.83 6.52,29.83 5.98,29.83 8.65,29.29 9.18,29.29 7.58,29.29 8.12,29.29 7.05,29.29 6.52,29.29 5.98,29.29 8.65,28.76 9.18,28.76 7.58,28.76 8.12,28.76 7.05,28.76 6.52,28.76 5.98,28.76 8.65,28.23 9.18,28.23 7.58,28.23 8.12,28.23 7.05,28.23 6.52,28.23 5.98,28.23 8.65,27.69 9.18,27.69 7.58,27.69 8.12,27.69 7.05,27.69 6.52,27.69 5.98,27.69 8.65,27.16 9.18,27.16 7.58,27.16 8.12,27.16 7.05,27.16 6.52,27.16 5.98,27.16
  pour Bottom (rank 2, no thermals): 20.64,26.63 20.64,34.07 37.66,34.07 37.66,26.63
  pour Route2 (rank 6, no thermals): 20.64,34.07 37.66,34.07 37.66,26.63 20.64,26.63
  pour Route15 (rank 6, no thermals): 20.64,34.07 37.66,34.07 37.66,26.63 20.64,26.63
  pour Top (rank 3, no thermals): 20.64,26.63 20.64,29 37.66,29 37.66,26.63
  pour Top (no thermals): 37.66,10.17 20.64,10.17 20.64,23.91 37.66,23.91
  pour Bottom (no thermals): 37.66,10.17 20.64,10.17 20.64,23.91 37.66,23.91
  pour Route2 (no thermals): 37.66,10.17 37.66,23.91 20.64,23.91 20.64,10.17
  pour Route15 (rank 2, no thermals): 20.64,15.94 20.64,23.91 37.66,23.91 37.66,15.94
  pour Top (no thermals): 57.56,40.35 37.66,40.35 37.66,10.17 57.56,10.17
  pour Route15 (isolate 0.203, rank 2, no thermals): 57.56,10.17 37.66,10.17 37.66,40.35 57.56,40.35
  pour Route15 (isolate 0.203, rank 2, no thermals): 0.76,40.35 0.76,10.17 20.64,10.17 20.64,40.35
  pour Top (isolate 0.203, rank 2, no thermals): 0.76,40.35 0.76,10.17 20.64,10.17 20.64,40.35
GND_A  (via drill 0.2, 0.2 pad 0.45)  (1 unrouted)
  Top 0.152: U$32.P$1 v30.96,21.68
  Route2 0.152: v30.96,21.68 30.47,22.16 30.47,23.95 30.47,24.66 29.76,25.37 28.92,25.37 28.48,25.81 27.91,25.81 27.58,26.14 26.11,26.14 26.11,26.69
  Route2 0.203: v27.35,28.73 27.17,28.73 27.1,28.8 26.76,28.8 26.11,28.15 26.11,26.69
  Route15 0.152: v23.73,19.48 24.18,19.93 24.92,19.93 26.27,21.29 29.35,21.29 30.14,22.07 30.46,22.07 30.85,21.68 v30.96,21.68
  Route15 0.203: v27.35,28.73 27.35,30.85 25.64,32.56 v21.2,32.56
  Bottom 0.152: v23.73,19.48 23.73,19.15 U$21.24-SP1
  Bottom 0.203: U$30.P$10 v27.35,28.73 | v21.2,32.56 22.07,33.43 23.02,33.43
GND_C  (via drill 0.2, 0.2 pad 0.45)
  Top 0.152: U$32.P$7 v28.56,22.05 | v24.51,20.33 24.51,19.79 24.36,19.64 v24.36,16.8
  Route2 0.152: v28.56,22.05 v28.55,22.06
  Route15 0.152: v24.51,20.33 26.63,22.45 27.95,22.45 28.34,22.05 v28.56,22.05 28.56,24.55 29.13,25.13 29.86,25.13 31.17,26.44 31.17,26.68
  Route15 0.203: 37.66,31.67 35.9,31.67 34.04,29.81 32.78,29.81 32.49,30.11 32.15,30.11 31.85,29.81 v31.78,29.81 31.65,29.69 31.56,29.69 31.31,29.44 31.31,28.22 30.96,27.87 30.96,27.52 31.17,27.31 31.17,26.68
  Bottom 0.089: C44.2 v24.51,20.33
  Bottom 0.152: 24.16,16.74 U$21.20-SP3 24.29,16.73 v24.36,16.8
  Bottom 0.203: U$30.P$4 29.75,29.55 30.23,30.03 31.56,30.03 v31.78,29.81
I2C_SCL  (via drill 0.2)
  Top 0.089: U2.33 32.2,15.06 31.64,15.63 31.64,16.47 31.41,16.7 31.41,18.02 31.66,18.27 31.66,18.57 31.58,18.64 v31.58,20.4
  Route15 0.089: v35.49,25.39 35.7,25.39 35.88,25.21 36.18,25.21 36.72,25.74 45.8,25.74 46.76,24.78 46.76,21.08 47.29,20.55 50.2,20.55 51.17,19.58 JP3.3
  Bottom 0.089: v31.58,20.4 31.58,21.56 31.11,22.04 30.21,22.04 29.6,22.66 28.71,22.66 28.56,22.81 U$1.P$7 28.56,23.91 | 28.56,23.91 | 28.56,23.91 29.04,24.39 29.04,24.64 29.25,24.86 30.13,24.86 30.85,25.57 35.31,25.57 v35.49,25.39
I2C_SDA  (via drill 0.2)
  Top 0.089: U2.34 32.25,15.56 31.82,16 31.82,16.62 32.62,17.42 32.62,20.23 v32.42,20.43
  Route15 0.089: v34.95,25.21 35.16,25.21 35.34,25.03 36.26,25.03 36.79,25.56 45.73,25.56 46.58,24.71 46.58,21.01 47.21,20.38 50.13,20.38 50.28,20.23 50.28,18.51 51.17,17.62 JP3.2
  Bottom 0.089: v32.42,20.43 32.2,20.65 32.2,21.6 32.12,21.68 31.72,21.68 31.18,22.22 30.29,22.22 29.67,22.83 29.08,22.83 28.96,22.96 U$1.P$6 28.96,23.9 | 28.96,23.9 | 28.96,23.9 29.13,24.07 29.67,24.07 29.8,24.2 29.8,24.27 30.92,25.39 34.77,25.39 v34.95,25.21
INPUT  (via drill 0.2)
  Top 0.089: v25.32,17.19 25.58,17.46 U2.9
  Route2 0.089: v34.4,25.03 34.62,25.03 34.8,24.85 35.83,24.85 36.37,25.39 37.15,25.39 45.66,25.39 46.41,24.64 46.41,20.93 47.14,20.2 49.13,20.2 50.28,19.05 50.28,15.97 51.17,15.08 JP3.1
  Route15 0.089: 29.02,19.01 | 29.02,19.01 29.35,19.34 30.4,19.34 30.73,19.68 32.17,19.68 32.78,20.28 32.78,20.58 32.56,20.8 v32.56,20.98 | 29.02,19.01 28.75,18.74 25.95,18.74 25.31,18.1 25.17,18.1 24.96,17.89 24.96,17.55 v25.32,17.19
  Bottom 0.089: v32.56,20.98 32.56,21.49 32.19,21.85 31.8,21.85 31.25,22.4 30.36,22.4 29.76,23 U$1.P$4 29.76,23.91 29.98,24.13 29.98,24.2 31,25.22 34.22,25.22 v34.4,25.03
LED  (via drill 0.2)
  Top 0.089: U2.22 29.01,11.81 29.01,12.04 28.76,12.29 27.55,12.29 26.71,11.45 v26.71,10.84 | LED9.A 24.58,12 v24.61,12
  Bottom 0.089: v26.71,10.84 26.67,10.84 26.31,10.48 26.02,10.48 25.4,11.1 25.4,11.21 v24.61,12
N$1
  Top 0.152: U$2.P$1 27.88,2.93 27.14,3.67 22.1,3.67 20.56,5.21 JP5.9
N$2  (via drill 0.2)
  Top 0.152: U2.6 29.15,17.81 29.4,18.05 C3.1 v29.4,18.88 C40.1
  Route2 0.152: v36,12.32 35.06,13.25 35.06,18.19 v34.94,18.19
  Route15 0.152: v29.4,18.88 29.94,18.88 30.8,18.02 33.52,18.02 34.26,18.77 34.59,18.77 34.94,18.42 v34.94,18.19
  Bottom 0.152: v36,12.32 R1.1
N$3
  Top 0.152: U$2.P$2 28.28,2.87 27.24,3.91 23.35,3.91 JP5.8
N$4
  Top 0.152: U$2.P$3 28.68,2.81 27.34,4.15 25.65,4.15 JP5.7 25.64,5.21 26.7,6.26 30.11,6.26 30.73,5.64 30.73,4.77 29.88,3.93 U$2.P$6
N$5
  Top 0.152: U$2.P$4 29.08,3.26 JP5.6
N$6
  Top 0.152: U$2.P$5 29.48,5.02 JP5.5
N$7
  Top 0.152: U$2.P$9 31.08,3.06 31.93,3.91 34.95,3.91 36.24,5.21 JP5.2
N$8
  Top 0.152: U$2.P$7 30.28,3.28 JP5.4
N$9
  Top 0.152: U$2.P$8 30.68,3 31.83,4.15 32.65,4.15 33.7,5.21 JP5.3
N$10
  Bottom 0.152: U$21.46-DVDD 33.13,14.23 33.37,14.47 33.7,14.47 34.2,13.96 C36.1
N$11
  Top 0.152: U$2.P$10 31.48,3.12 32.03,3.67 37.25,3.67 38.78,5.21 JP5.1
N$12
  Bottom 0.089: U$21.15-AVDD 24.13,14.22 23.76,14.22 23.44,13.9 23.44,13.06 23.72,12.78 C34.1
N$13
  Bottom 0.152: C38.1 33.58,18.73 U$21.37-VCP_LSD
N$14
  Bottom 0.152: C31.2 33.58,16.23 U$21.42-CP1L
N$16
  Bottom 0.152: U$21.43-CP1H 33.26,15.73 33.27,15.74 34.09,15.74 C31.1
N$20
  Bottom 0.152: C32.2 33.55,17.23 U$21.40-CP2L
N$21
  Bottom 0.152: U$21.39-CP2H 33.17,17.73 33.24,17.8 34.09,17.8 C32.1
N$22  (via drill 0.2)
  Top 0.152: v34.65,15.58 R13.1
  Bottom 0.152: U$21.44-VDRAIN 33.11,15.23 33.37,15.49 33.7,15.49 33.83,15.36 34.43,15.36 v34.65,15.58
N$23
  Bottom 0.152: U$21.38-VCPH 33.26,18.23 33.45,18.04 34.19,18.04 34.43,17.8 35.1,17.8 35.33,18.03 35.33,18.04 C14.2
N$81
  Top 0.089: LED9.C 22.43,12.24 R24.2
NFAULT  (via drill 0.2)
  Top 0.089: U2.3 30.66,17.16 30.15,16.65 27.65,16.65 27.39,16.39 27.39,15.89 27.31,15.81 26.98,15.81 26.97,15.81 26.2,15.81 26.08,15.69 25.75,15.69 25.75,15.68 v25.48,15.68
  Bottom 0.089: U$21.8-NFAULT 27.65,12.55 27.85,12.75 27.85,13.05 27.64,13.26 25.76,13.26 25.68,13.34 25.68,15.51 25.5,15.68 v25.48,15.68
NRST  (via drill 0.2)
  Top 0.089: R16.2 v31.08,19.1 31.08,18.71 30.94,18.57 30.94,18.28 30.75,18.1 30.49,18.1 30.15,17.76 U2.4
  Route2 0.089: v33.86,24.86 34.07,24.86 34.26,24.67 35.9,24.67 36.44,25.21 37.07,25.21 45.58,25.21 46.23,24.56 46.23,20.86 47.74,19.35 47.74,14.7 JP2.1
  Bottom 0.089: v31.08,19.1 31.27,19.28 31.77,19.28 32.92,20.43 32.92,21.13 32.74,21.31 32.74,21.56 32.27,22.03 31.87,22.03 31.33,22.57 30.44,22.57 30.16,22.85 U$1.P$3 30.16,24.12 31.07,25.04 33.68,25.04 v33.86,24.86
PWM_AH  (via drill 0.2)
  Top 0.089: U2.29 33.12,13.06 33.37,12.81 v33.37,12.75
  Bottom 0.089: U$21.2-INHA 30.65,12.58 30.79,12.73 31.26,12.73 31.45,12.92 32.7,12.92 32.87,12.75 v33.37,12.75
PWM_AL  (via drill 0.2)
  Top 0.089: U2.30 33.51,13.56 v33.53,13.53
  Bottom 0.089: U$21.3-INLA 30.15,12.74 30.31,12.9 31.18,12.9 31.76,13.48 33.48,13.48 v33.53,13.53
PWM_BH  (via drill 0.2)
  Top 0.089: U2.31 33.52,14.06 v33.53,14.08
  Bottom 0.089: U$21.4-INHB 29.65,12.76 29.97,13.08 31.11,13.08 32,13.98 33.43,13.98 v33.53,14.08
PWM_BL  (via drill 0.2)
  Top 0.089: v33.53,15.1 32.99,14.56 U2.32
  Bottom 0.089: U$21.5-INLB 29.15,12.78 29.63,13.26 31.04,13.26 31.94,14.16 31.94,14.9 32.02,14.98 33.41,14.98 v33.53,15.1
PWM_CH  (via drill 0.2)  (1 unrouted)
  Bottom 0.089: v28.65,11.66 U$21.6-INHC
PWM_CL  (via drill 0.2)  (1 unrouted)
  Bottom 0.089: v28.15,11.39 U$21.7-INLC
SH_A  (via drill 0.2, 0.2 pad 0.45, 0.4, 1)
  Top 0.089: 0018.2 v27.17,19.1
  Top 0.152: U$32.P$2 30.65,20.81 U$21.35-SH_A
  Top 0.203: U$25.D 25.33,29.56 v26.58,29.56
  Route2 0.152: U$21.35-SH_A 29.76,21.11 29.76,23.22 29.99,23.45 29.99,24.46 29.56,24.89 28.72,24.89 28.28,25.33 27.71,25.33 27.38,25.66 25.58,25.66 25.58,26.69
  Route2 0.203: v26.58,29.56 25.58,28.57 25.58,26.69
  Route15 0.152: v27.17,19.1 27.41,19.34 27.64,19.34 27.85,19.55 30.31,19.55 30.65,19.89 U$21.35-SH_A
  Bottom 0.203: U$30.P$9 27.75,29.7 27.7,29.75 27.17,29.75 26.89,29.47 26.67,29.47 v26.58,29.56
  other vias: 21.81,35.08 22.38,40.35 23.64,40.35 24.9,40.35 21.81,34.55 22.35,35.08 22.35,34.55 22.88,35.08 22.88,34.55 23.41,35.08 23.41,34.55 23.95,35.08 24.48,35.08 25.01,35.08 25.55,35.08 23.95,34.55 24.48,34.55 25.01,34.55 25.55,34.55 26.08,35.08 26.08,34.55 30.65,20.23
  pour Bottom (no thermals): 21.52,34.28 21.52,40.35 26.38,40.35 26.38,34.28
  pour Top (rank 2, no thermals): 26.38,29 26.38,35.46 21.52,35.46 21.52,29
SH_A1  (via drill 1)  (2 unrouted)
  other vias: 35.92,10.17 34.66,10.17 33.41,10.17
SH_B  (via drill 0.2, 0.2 pad 0.45, 0.4, 1)
  Top 0.089: 0020.2 v26.38,19.3
  Top 0.152: U$32.P$3 30.16,21.54 v30.3,21.68
  Route2 0.152: v28.15,29.93 27.34,29.12 26.7,29.12 25.85,28.26 25.85,25.9 27.48,25.9 27.81,25.57 28.38,25.57 28.82,25.13 29.66,25.13 30.23,24.56 30.23,21.75 v30.3,21.68
  Route15 0.152: v30.3,21.68 30.09,21.68 29.45,21.05 28.91,21.05 28.26,20.39 28.26,20.08 v28.14,19.97 27.93,19.97 27.54,19.58 26.66,19.58 v26.38,19.3
  Bottom 0.089: v26.38,19.3 26.38,19.49 26.39,19.49
  Bottom 0.152: v28.14,19.97 v28.15,19.97 U$21.30-SH_B | 30.28,21.68 v30.3,21.68
  Bottom 0.203: U$30.P$8 v28.15,29.93 | v28.15,29.93
  other vias: 26.82,35.08 27.9,40.35 29.15,40.35 30.41,40.35 26.82,34.55 27.36,35.08 27.89,35.08 28.42,35.08 28.96,35.08 29.49,35.08 30.02,35.08 30.56,35.08 31.09,35.08 27.36,34.55 27.89,34.55 28.42,34.55 28.96,34.55 29.49,34.55 30.02,34.55 30.56,34.55 31.09,34.55
  pour Bottom (no thermals): 26.73,34.28 26.73,40.35 31.59,40.35 31.59,34.28
  pour Top (rank 2, no thermals): 31.58,29 31.58,35.46 26.73,35.46 26.73,29
SH_B1  (via drill 1)  (2 unrouted)
  other vias: 30.41,10.17 29.15,10.17 27.9,10.17
SH_C  (via drill 0.2, 0.2 pad 0.45, 0.4, 1)
  Top 0.089: 0016.2 23.42,14.92 23.42,14.1 23.34,14.02 22.63,14.02 22.55,14.1 22.55,16.48 22.91,16.84 22.91,18.61 v23.2,18.89
  Top 0.152: U$32.P$6 v28.96,21.68 28.95,21.69 28.95,22.22 28.48,22.69 27.37,22.69 26.08,21.4 26.08,20.61 26.18,20.51 26.37,20.51 v26.64,20.23
  Route2 0.152: v28.96,21.68 28.95,21.69
  Route15 0.089: v26.64,20.23 26.46,20.05 26.46,19.97 26.12,19.63 25.75,19.63 25,18.87 23.48,18.87 23.45,18.89 v23.2,18.89
  Route15 0.152: 31.76,26.69 29.96,24.89 29.23,24.89 28.96,24.61 v28.96,21.68
  Route15 0.203: 31.76,26.69 31.76,27.49 31.79,27.52 31.79,27.87 32.32,28.39 v32.32,29.69
  Bottom 0.152: U$21.27-SH_C v26.65,20.23 v26.64,20.23
  Bottom 0.203: U$30.P$5 29.35,29.56 30.11,30.32 31.86,30.32 32.19,29.99 32.19,29.81 v32.32,29.69
  other vias: 36.49,35.08 33.41,40.35 34.66,40.35 35.92,40.35 35.96,35.08 36.49,34.55 35.96,34.55 35.43,35.08 34.89,35.08 34.36,35.08 33.83,35.08 33.29,35.08 32.76,35.08 32.23,35.08 35.43,34.55 34.89,34.55 34.36,34.55 33.83,34.55 33.29,34.55 32.76,34.55 32.23,34.55
  pour Bottom (no thermals): 31.93,34.28 31.93,40.35 36.8,40.35 36.8,34.28
  pour Top (no thermals): 36.8,29 36.8,35.46 31.93,35.46 31.93,29
SH_C1  (via drill 1)  (2 unrouted)
  other vias: 24.9,10.17 23.64,10.17 22.38,10.17
SL_A  (via drill 0.2, 0.2 pad 0.45, 0.4)  (1 unrouted)
  Top 0.152: v32.81,22.64 32.68,22.51 31.68,22.51 31.5,22.69 30.78,22.69 30.68,22.79 30.68,22.97 U$32.P$12 30.56,23.92 29.3,25.18 25.53,25.18 25.29,25.42 25.29,26.68
  Top 0.203: 24.66,28.32 v24.48,28.5 | v26.93,28.38 26.8,28.25 26.1,28.25 25.82,27.97 | 25.3,27.97 25.82,27.97 | 25.3,27.97 v24.48,27.97 | 25.31,27.97 25.3,27.97 | 25.82,27.97 25.42,27.57 25.29,27.44 25.29,26.68
  Route2 0.152: v30.15,19.94 29.79,19.58 29.79,18.72 29.56,18.49 28.34,18.49 27.33,19.49 26.75,19.49 26.51,19.73 25.06,19.73 24.96,19.63 24.91,19.63 C42.1
  Route2 0.203: v27.75,28.32 27.54,28.32 27.52,28.31 27,28.31 v26.93,28.38
  Route15 0.152: v30.15,19.94 30.25,20.05 30.25,20.39 30.48,20.62 30.79,20.62 v32.81,22.64
  Bottom 0.089: U$30.P$19 v27.75,28.32
  Bottom 0.152: v30.15,19.94 U$21.34-SL_A 30.15,19.81 | C42.1 24.76,19.04 24.88,18.91 24.88,18.55 24.57,18.23 U$21.23-SN1
  other vias: 21.81,26.9 21.81,27.44 21.81,27.97 21.81,28.51 22.35,28.51 22.88,28.51 23.41,28.51 23.95,28.51 22.35,27.97 22.88,27.97 23.41,27.97 23.95,27.97 22.35,27.44 22.88,27.44 23.41,27.44 23.95,27.44 24.48,27.44 22.35,26.9 22.88,26.9 23.41,26.9 23.95,26.9 24.48,26.9 24.76,19.48
  pour Bottom (no thermals): 24.9,29.13 24.9,26.63 21.39,26.63 21.39,29.13
SL_B  (via drill 0.2)  (1 unrouted)
  Top 0.152: U$32.P$13 30.16,22.91 30.62,22.45 31.4,22.45 31.6,22.25 32.98,22.25 33.21,22.48 33.21,22.81 32.81,23.2 v32.81,23.32 32.81,23.91 30.86,25.86 30.24,25.86 29.9,26.21 28.67,26.21 28.49,26.38 28.49,27.27
  Route15 0.152: v32.81,23.32 32.6,23.32 32.54,23.37 32.22,23.37 31.99,23.14 31.99,22.16 31.12,21.29 30.03,21.29 29.55,20.81 29.22,20.81 U$21.31-SL_B
  other vias: 28.65,20.23
SL_C  (via drill 0.2, 0.2 pad 0.45, 0.4)  (2 unrouted)
  Top 0.152: U$32.P$10 v27.36,21.68 | C44.1 24.12,19.96 24.12,18.52 23.29,17.69 23.29,17 23.52,16.77 23.6,16.77 U$21.19-SN3
  Route2 0.152: v27.36,21.68 27.36,23.27 26.83,23.8 26.83,24.44 27.02,24.63 v27.02,24.78
  Route15 0.152: v26.1,20.12 25.95,20.12 24.91,19.08 23.56,19.08 23.33,19.31 23.33,19.64 23.76,20.06 C44.1
  Bottom 0.152: v27.36,21.68 26.66,21.68 26.63,21.71 26.18,21.71 26.08,21.61 26.08,20.82 26.15,20.76 U$21.26-SL_C 26.15,20.17 v26.1,20.12 | 31.38,26.68 30.83,26.14 30.61,26.14 29.9,25.42 29.01,25.42 28.59,25 27.81,25 27.59,24.78 v27.02,24.78
  Bottom 0.203: U$30.P$1 31.38,28.79 v31.38,27.69 | v31.38,27.69 33.01,27.69 33.09,27.62 | 31.38,26.68 v31.38,27.69
  other vias: 35.49,26.91 35.49,27.44 35.49,27.98 34.95,26.91 34.42,26.91 33.88,26.91 33.35,26.91 32.82,26.91 32.28,26.91 34.95,27.44 34.42,27.44 33.88,27.44 33.35,27.44 32.82,27.44 34.95,27.98 34.42,27.98 33.88,27.98 33.35,27.98 32.82,27.98 23.76,20.33 24.15,16.23
  pour Bottom (no thermals): 32.76,29.11 36.91,29.11 36.91,26.63 32.76,26.63
SPI_CS  (via drill 0.2)
  Top 0.089: U2.17 27.33,13.06 v27.49,12.9
  Bottom 0.089: v27.49,12.9 27.15,12.56 U$21.9-NSCS
SPI_MISO  (via drill 0.2)
  Top 0.089: 26.43,15.04 26.74,15.04 U2.13 26.68,14.99 26.13,14.99 25.7,14.56 v25.32,14.56
  Bottom 0.089: U$21.11-SDO 26.15,12.1 25.82,12.43 25.2,12.43 25.03,12.6 25.03,14.27 v25.32,14.56
SPI_MOSI  (via drill 0.2)
  Top 0.089: U2.14 26.45,14.56 25.39,13.5 v25.39,13.12
  Bottom 0.089: 26.65,12.12 U$21.10-SDI 26.65,12.1 26.32,12.43 26.07,12.43 v25.39,13.12
SPI_SCK  (via drill 0.2)
  Top 0.089: U2.12 26.2,15.56 26.16,15.51 25.83,15.51 25.59,15.28 25.12,15.28 v25.06,15.35
  Bottom 0.089: U$21.12-SCLK 24.85,12.52 24.85,14.35 24.96,14.45 24.96,14.71 25.06,14.81 v25.06,15.35
SWCLK  (via drill 0.2)
  Top 0.089: U2.28 v32.07,12.56
  Route2 0.089: v33.1,21.46 32.92,21.28 32.92,19.47 32.7,19.25 32.7,13.6 32.07,12.97 v32.07,12.56
  Route15 0.089: v33.32,24.68 33.53,24.68 33.71,24.49 34.96,24.49 35.32,24.85 36.33,24.85 36.87,25.39 45.66,25.39 46.41,24.64 46.41,20.93 47.14,20.2 47.32,20.2 JP2.3
  Bottom 0.089: v33.1,21.46 v33.09,21.46 32.34,22.21 31.94,22.21 31.4,22.75 30.67,22.75 30.56,22.87 U$1.P$2 30.56,23.91 | 30.56,23.91 | 30.56,23.91 30.56,24.27 31.14,24.86 33.14,24.86 v33.32,24.68
SWDIO  (via drill 0.2)
  Top 0.089: U2.25 30.91,11.91 30.91,12.22 30.98,12.29 31.32,12.29 31.4,12.22 31.4,11.06 v31.65,10.81
  Route2 0.089: v33.39,21.94 33.39,21.68 33.46,21.61 33.46,19.76 32.88,19.17 32.88,13.16 32.43,12.71 32.43,12.41 32.12,12.11 32.12,11.51 31.65,11.04 v31.65,10.81
  Route15 0.089: v32.78,24.5 32.99,24.5 33.17,24.32 35.03,24.32 35.39,24.67 36.4,24.67 36.94,25.21 45.58,25.21 46.23,24.56 46.23,20.86 47.74,19.35 47.74,17.24 JP2.2
  Bottom 0.089: v33.39,21.94 32.87,21.94 32.42,22.39 32.02,22.39 31.47,22.93 31.01,22.93 30.96,22.98 U$1.P$1 30.96,24.42 31.22,24.68 32.59,24.68 v32.78,24.5
VMOTOR  (via drill 0.2, 0.4, 1)  (23 unrouted)
  Top 0.089: 0001.2 20.68,14.5 v20.64,14.54 | v36.16,19.68 v35.83,19.68 35.83,19.81 v35.99,19.97 35.85,20.11 35.85,20.28 | v36.49,20.83 36.32,20.66 v36.32,20.54 36.32,20.42 v36.49,20.26 36.49,20.14 v36.32,19.97 36.49,19.81 v36.49,19.68 36.16,20.01 v36.16,20.26 v35.83,20.26 35.85,20.28 | v35.83,20.83 35.99,20.66 v35.99,20.54 35.99,20.42 35.85,20.28
  Top 1.27: R13.2 36.35,17.37 36.16,17.37 v36.16,20.26 | v37.66,38.5 v37.66,37.24 v37.66,35.99 v37.66,34.73 v37.66,33.47 | v37.66,12.03 v37.66,13.28 v37.66,14.54 v37.66,15.8 v37.66,17.06 | C22.+ 50,21.45 | v20.64,38.5 v20.64,37.24 v20.64,35.99 v20.64,34.73 v20.64,33.47 | v20.64,17.06 v20.64,15.8 v20.64,14.54 v20.64,13.28 v20.64,12.03
  Route15 0.406: v20.64,14.54 24.1,14.54 24.6,14.04 30.32,14.04 30.39,13.97 31.67,13.97 33.32,15.62 33.75,15.62 34.31,15.06 36.93,15.06 v37.66,15.8
  Route15 0.508: v20.64,17.06 v20.64,14.54
  Bottom 0.152: U$21.41-PVDD 33.2,16.73 33.24,16.76 35.96,16.76 C14.1 C13.1 | C41.1 C43.1 v36.16,20.26 | v20.64,17.06 22.21,17.06 C33.1 C30.1
  other vias: 35.95,15.77 36.28,15.75 36.13,16.05 36.46,16.03 36.61,15.74 36.44,15.46 36.11,15.47 36.31,16.33 35.98,16.34 36.64,16.31 36.77,15.45 36.79,16.02 36.16,20.83 22.46,17.8 22.47,17.47 22.46,17.14 22.47,18.13 41.2,23.35 41.73,23.35 42.27,23.35 42.8,23.35 41.2,22.82 41.73,22.82 42.27,22.82 42.8,22.82 41.2,22.28 41.73,22.28 42.27,22.28 42.8,22.28 41.2,21.75 41.73,21.75 42.27,21.75 42.8,21.75 41.2,21.22 41.73,21.22 42.27,21.22 42.8,21.22 41.2,20.68 41.73,20.68 42.27,20.68 42.8,20.68 41.19,19.8 41.73,19.8 42.26,19.8 42.79,19.8 41.19,19.27 41.73,19.27 42.26,19.27 42.79,19.27 41.19,18.73 41.73,18.73 42.26,18.73 42.79,18.73 41.19,18.2 41.73,18.2 42.26,18.2 42.79,18.2 41.19,17.67 41.73,17.67 42.26,17.67 42.79,17.67 41.19,17.13 41.73,17.13 42.26,17.13 42.79,17.13 49.28,23.79 48.75,23.79 50.35,23.79 49.82,23.79 50.88,23.79 51.42,23.79 51.95,23.79 49.28,23.26 48.75,23.26 50.35,23.26 49.82,23.26 50.88,23.26 51.42,23.26 51.95,23.26 49.28,22.73 48.75,22.73 50.35,22.73 49.82,22.73 50.88,22.73 51.42,22.73 51.95,22.73 49.28,22.19 48.75,22.19 50.35,22.19 49.82,22.19 50.88,22.19 51.42,22.19 51.95,22.19 49.28,21.66 48.75,21.66 50.35,21.66 49.82,21.66 50.88,21.66 51.42,21.66 51.95,21.66 49.28,21.13 48.75,21.13 50.35,21.13 49.82,21.13 50.88,21.13 51.42,21.13 51.95,21.13 49.56,39.83 49.03,39.83 50.63,39.83 50.1,39.83 51.16,39.83 51.7,39.83 52.23,39.83 49.56,39.29 49.03,39.29 50.63,39.29 50.1,39.29 51.16,39.29 51.7,39.29 52.23,39.29 49.56,38.76 49.03,38.76 50.63,38.76 50.1,38.76 51.16,38.76 51.7,38.76 52.23,38.76 49.56,38.23 49.03,38.23 50.63,38.23 50.1,38.23 51.16,38.23 51.7,38.23 52.23,38.23 49.56,37.69 49.03,37.69 50.63,37.69 50.1,37.69 51.16,37.69 51.7,37.69 52.23,37.69 49.56,37.16 49.03,37.16 50.63,37.16 50.1,37.16 51.16,37.16 51.7,37.16 52.23,37.16 41.66,39.85 41.13,39.85 42.73,39.85 42.2,39.85 43.26,39.85 43.8,39.85 44.33,39.85 41.66,39.31 41.13,39.31 42.73,39.31 42.2,39.31 43.26,39.31 43.8,39.31 44.33,39.31 41.66,38.78 41.13,38.78 42.73,38.78 42.2,38.78 43.26,38.78 43.8,38.78 44.33,38.78 41.66,38.25 41.13,38.25 42.73,38.25 42.2,38.25 43.26,38.25 43.8,38.25 44.33,38.25 41.66,37.71 41.13,37.71 42.73,37.71 42.2,37.71 43.26,37.71 43.8,37.71 44.33,37.71 41.66,37.18 41.13,37.18 42.73,37.18 42.2,37.18 43.26,37.18 43.8,37.18 44.33,37.18 17.15,23.27 16.62,23.27 16.08,23.27 15.55,23.27 17.15,22.74 16.62,22.74 16.08,22.74 15.55,22.74 17.15,22.21 16.62,22.21 16.08,22.21 15.55,22.21 17.15,21.67 16.62,21.67 16.08,21.67 15.55,21.67 17.15,21.14 16.62,21.14 16.08,21.14 15.55,21.14 17.15,20.61 16.62,20.61 16.08,20.61 15.55,20.61 17.16,19.72 16.62,19.72 16.09,19.72 15.56,19.72 17.16,19.19 16.62,19.19 16.09,19.19 15.56,19.19 17.16,18.66 16.62,18.66 16.09,18.66 15.56,18.66 17.16,18.12 16.62,18.12 16.09,18.12 15.56,18.12 17.16,17.59 16.62,17.59 16.09,17.59 15.56,17.59 17.16,17.06 16.62,17.06 16.09,17.06 15.56,17.06 8.9,23.3 9.43,23.3 7.83,23.3 8.36,23.3 7.3,23.3 6.76,23.3 6.23,23.3 8.9,22.77 9.43,22.77 7.83,22.77 8.36,22.77 7.3,22.77 6.76,22.77 6.23,22.77 8.9,22.24 9.43,22.24 7.83,22.24 8.36,22.24 7.3,22.24 6.76,22.24 6.23,22.24 8.9,21.7 9.43,21.7 7.83,21.7 8.36,21.7 7.3,21.7 6.76,21.7 6.23,21.7 8.9,21.17 9.43,21.17 7.83,21.17 8.36,21.17 7.3,21.17 6.76,21.17 6.23,21.17 8.9,20.64 9.43,20.64 7.83,20.64 8.36,20.64 7.3,20.64 6.76,20.64 6.23,20.64 8.72,39.87 9.26,39.87 7.66,39.87 8.19,39.87 7.12,39.87 6.59,39.87 6.06,39.87 8.72,39.33 9.26,39.33 7.66,39.33 8.19,39.33 7.12,39.33 6.59,39.33 6.06,39.33 8.72,38.8 9.26,38.8 7.66,38.8 8.19,38.8 7.12,38.8 6.59,38.8 6.06,38.8 8.72,38.27 9.26,38.27 7.66,38.27 8.19,38.27 7.12,38.27 6.59,38.27 6.06,38.27 8.72,37.73 9.26,37.73 7.66,37.73 8.19,37.73 7.12,37.73 6.59,37.73 6.06,37.73 8.72,37.2 9.26,37.2 7.66,37.2 8.19,37.2 7.12,37.2 6.59,37.2 6.06,37.2 16.59,39.85 17.13,39.85 15.53,39.85 16.06,39.85 14.99,39.85 14.46,39.85 13.93,39.85 16.59,39.32 17.13,39.32 15.53,39.32 16.06,39.32 14.99,39.32 14.46,39.32 13.93,39.32 16.59,38.79 17.13,38.79 15.53,38.79 16.06,38.79 14.99,38.79 14.46,38.79 13.93,38.79 16.59,38.25 17.13,38.25 15.53,38.25 16.06,38.25 14.99,38.25 14.46,38.25 13.93,38.25 16.59,37.72 17.13,37.72 15.53,37.72 16.06,37.72 14.99,37.72 14.46,37.72 13.93,37.72 16.59,37.19 17.13,37.19 15.53,37.19 16.06,37.19 14.99,37.19 14.46,37.19 13.93,37.19 15.01,23.27 14.48,23.27 13.94,23.27 15.01,22.74 14.48,22.74 13.94,22.74 15.01,22.21 14.48,22.21 13.94,22.21 15.01,21.67 14.48,21.67 13.94,21.67 15.01,21.14 14.48,21.14 13.94,21.14 15.01,20.61 14.48,20.61 13.94,20.61 15.02,19.72 14.48,19.72 13.95,19.72 15.02,19.19 14.48,19.19 13.95,19.19 15.02,18.66 14.48,18.66 13.95,18.66 15.02,18.12 14.48,18.12 13.95,18.12 15.02,17.59 14.48,17.59 13.95,17.59 15.02,17.06 14.48,17.06 13.95,17.06 43.35,23.35 43.88,23.35 44.41,23.35 43.35,22.82 43.88,22.82 44.41,22.82 43.35,22.28 43.88,22.28 44.41,22.28 43.35,21.75 43.88,21.75 44.41,21.75 43.35,21.22 43.88,21.22 44.41,21.22 43.35,20.68 43.88,20.68 44.41,20.68 43.34,19.8 43.87,19.8 44.41,19.8 43.34,19.27 43.87,19.27 44.41,19.27 43.34,18.73 43.87,18.73 44.41,18.73 43.34,18.2 43.87,18.2 44.41,18.2 43.34,17.67 43.87,17.67 44.41,17.67 43.34,17.13 43.87,17.13 44.41,17.13
  pour Top (rank 3, no thermals): 20.64,40.35 37.66,40.35 37.66,34.35 37.15,34.35 36.04,35.46 20.64,35.46
  pour Route15 (no thermals): 20.64,34.23 20.64,40.35 37.66,40.35 37.66,34.23
  pour Route2 (no thermals): 20.64,40.35 37.66,40.35 37.66,34.23 20.64,34.23
  pour Route15 (no thermals): 37.66,10.17 20.64,10.17 20.64,15.79 37.66,15.79
  pour Route2 (isolate 0.203, rank 2, no thermals): 57.56,10.17 37.66,10.17 37.66,40.35 57.56,40.35
  pour Bottom (isolate 0.203, rank 3, no thermals): 57.56,10.17 37.66,10.17 37.66,40.35 57.56,40.35
  pour Bottom (isolate 0.203, rank 3, no thermals): 0.76,10.17 20.64,10.17 20.64,40.35 0.76,40.35
  pour Route2 (isolate 0.203, rank 2, no thermals): 0.76,40.35 20.64,40.35 20.64,10.17 0.76,10.17

## Text on the board
Top: PADY MOSFETOW SA INNE W REALU !!! | PADY MOSFETOW SA INNE W REALU !!! | PADY MOSFETOW SA INNE W REALU !!!
tPlace: SWCLK | SWDIO | NRST | I2C_SCL | I2C_SDA | INPUT | CAN_RX | CAN_TX | GND